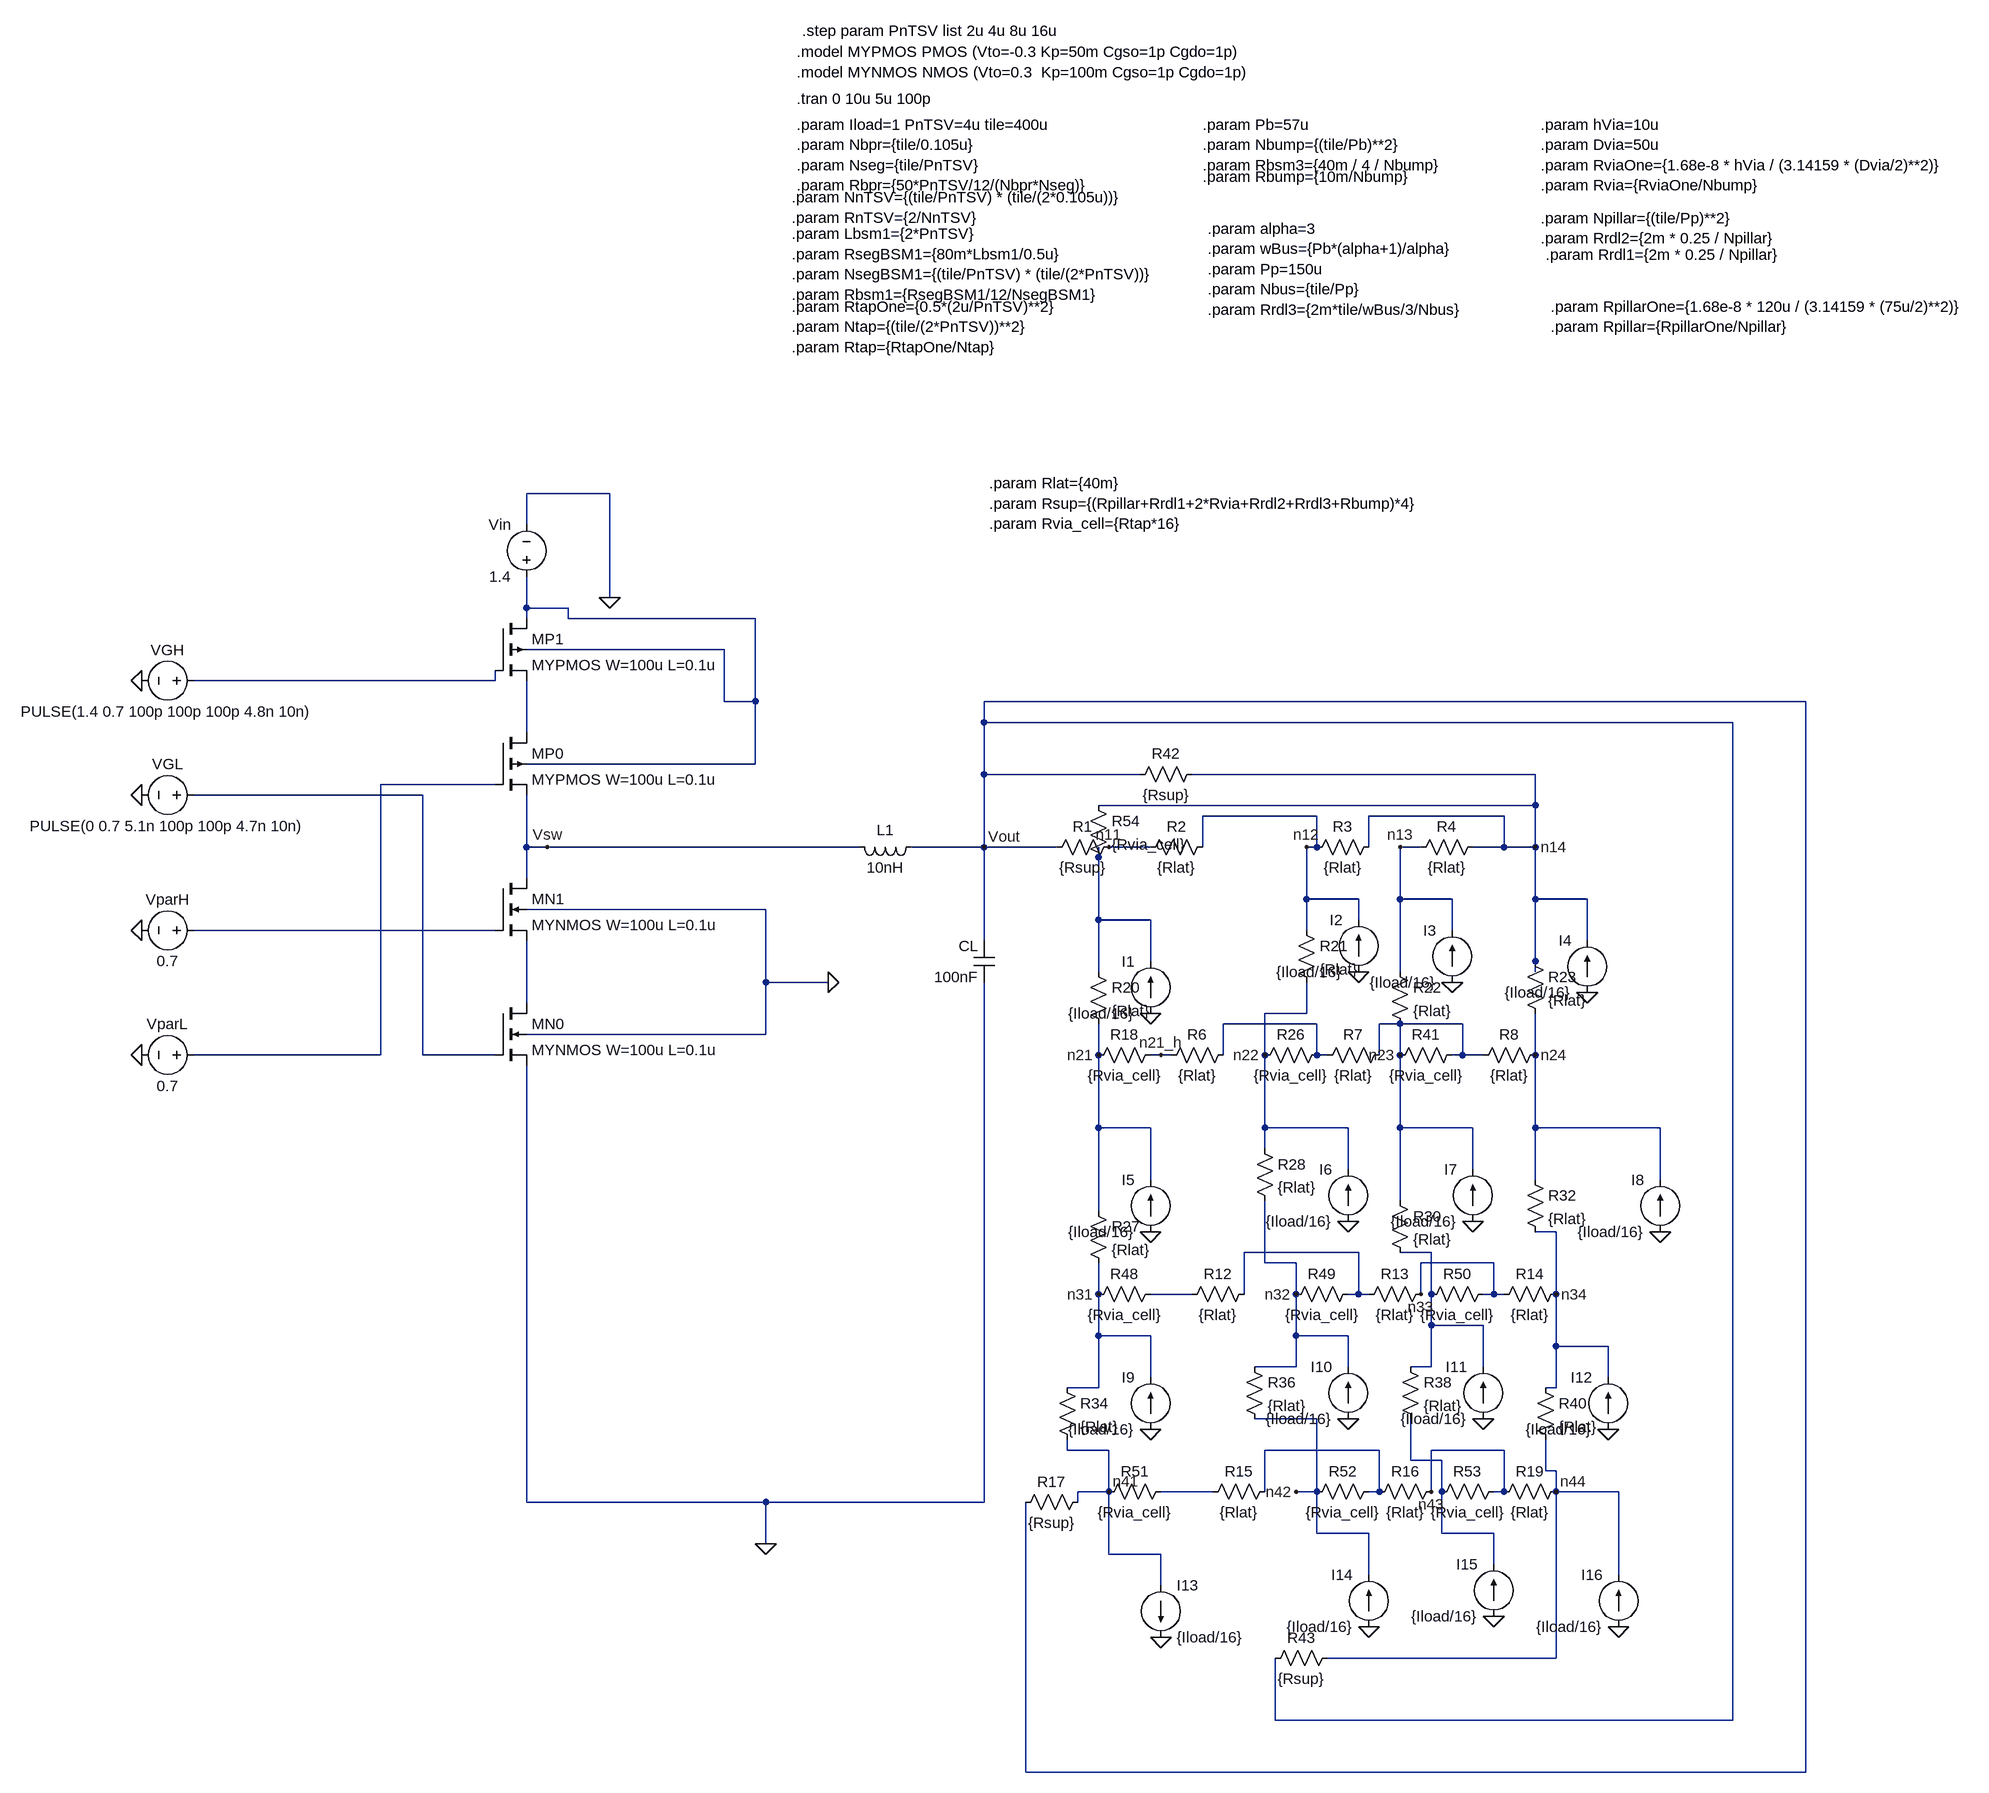
[diagram p0: schematic BuckConverter-WithLayers2D.asc]
BuckConverter-WithLayers2D.asc, the LTspice schematic file:
Version 4.1
SHEET 1 2640 2596
WIRE 448 576 320 576
WIRE 320 624 320 576
WIRE 448 736 448 576
WIRE 320 752 320 704
WIRE 384 752 320 752
WIRE 320 768 320 752
WIRE 384 768 384 752
WIRE 672 768 384 768
WIRE 624 816 320 816
WIRE 272 864 272 848
WIRE 272 864 -192 864
WIRE 624 896 624 816
WIRE 672 896 672 768
WIRE 672 896 624 896
WIRE 2288 896 1024 896
WIRE 1024 928 1024 896
WIRE 2176 928 1024 928
WIRE 320 944 320 864
WIRE 672 992 672 896
WIRE 672 992 320 992
WIRE 1024 1008 1024 928
WIRE 1264 1008 1024 1008
WIRE 1872 1008 1344 1008
WIRE 272 1024 96 1024
WIRE 160 1040 -192 1040
WIRE 1872 1056 1872 1008
WIRE 1872 1056 1200 1056
WIRE 1536 1072 1360 1072
WIRE 1824 1072 1616 1072
WIRE 320 1120 320 1040
WIRE 352 1120 320 1120
WIRE 832 1120 352 1120
WIRE 1024 1120 1024 1008
WIRE 1024 1120 912 1120
WIRE 1136 1120 1024 1120
WIRE 1280 1120 1216 1120
WIRE 1360 1120 1360 1072
WIRE 1536 1120 1536 1072
WIRE 1536 1120 1520 1120
WIRE 1616 1120 1616 1072
WIRE 1696 1120 1664 1120
WIRE 1824 1120 1824 1072
WIRE 1824 1120 1776 1120
WIRE 1872 1120 1872 1056
WIRE 1872 1120 1824 1120
WIRE 1200 1136 1200 1120
WIRE 320 1168 320 1120
WIRE 1520 1200 1520 1120
WIRE 1600 1200 1520 1200
WIRE 1664 1200 1664 1120
WIRE 1744 1200 1664 1200
WIRE 1872 1200 1872 1120
WIRE 1952 1200 1872 1200
WIRE 688 1216 320 1216
WIRE 1200 1232 1200 1136
WIRE 1280 1232 1200 1232
WIRE 1600 1232 1600 1200
WIRE 272 1248 -192 1248
WIRE 1520 1248 1520 1200
WIRE 1744 1248 1744 1200
WIRE 1024 1264 1024 1120
WIRE 1952 1264 1952 1200
WIRE 1280 1296 1280 1232
WIRE 1872 1296 1872 1200
WIRE 1200 1312 1200 1232
WIRE 1664 1312 1664 1200
WIRE 1872 1312 1872 1296
WIRE 688 1328 688 1216
WIRE 784 1328 688 1328
WIRE 320 1360 320 1264
WIRE 1520 1376 1520 1328
WIRE 1520 1376 1456 1376
WIRE 1536 1392 1392 1392
WIRE 1664 1392 1632 1392
WIRE 1760 1392 1664 1392
WIRE 688 1408 688 1328
WIRE 688 1408 320 1408
WIRE 96 1440 96 1024
WIRE 96 1440 -192 1440
WIRE 160 1440 160 1040
WIRE 272 1440 160 1440
WIRE 1200 1440 1200 1392
WIRE 1296 1440 1280 1440
WIRE 1312 1440 1296 1440
WIRE 1392 1440 1392 1392
WIRE 1456 1440 1456 1376
WIRE 1536 1440 1536 1392
WIRE 1552 1440 1536 1440
WIRE 1632 1440 1632 1392
WIRE 1664 1440 1664 1392
WIRE 1760 1440 1760 1392
WIRE 1760 1440 1744 1440
WIRE 1792 1440 1760 1440
WIRE 1872 1440 1872 1376
WIRE 1200 1552 1200 1440
WIRE 1280 1552 1200 1552
WIRE 1456 1552 1456 1440
WIRE 1584 1552 1456 1552
WIRE 1664 1552 1664 1440
WIRE 1776 1552 1664 1552
WIRE 1872 1552 1872 1440
WIRE 2064 1552 1872 1552
WIRE 1456 1584 1456 1552
WIRE 1584 1616 1584 1552
WIRE 1776 1616 1776 1552
WIRE 1280 1632 1280 1552
WIRE 1872 1632 1872 1552
WIRE 2064 1632 2064 1552
WIRE 1664 1664 1664 1552
WIRE 1200 1680 1200 1552
WIRE 1904 1712 1872 1712
WIRE 1600 1744 1424 1744
WIRE 1712 1744 1664 1744
WIRE 1456 1760 1456 1664
WIRE 1504 1760 1456 1760
WIRE 1808 1760 1696 1760
WIRE 1200 1808 1200 1760
WIRE 1344 1808 1280 1808
WIRE 1424 1808 1424 1744
WIRE 1504 1808 1504 1760
WIRE 1600 1808 1600 1744
WIRE 1600 1808 1584 1808
WIRE 1616 1808 1600 1808
WIRE 1696 1808 1696 1760
WIRE 1712 1808 1712 1744
WIRE 1808 1808 1808 1760
WIRE 1808 1808 1792 1808
WIRE 1824 1808 1808 1808
WIRE 1904 1808 1904 1712
WIRE 1712 1856 1712 1808
WIRE 1792 1856 1712 1856
WIRE 1200 1872 1200 1808
WIRE 1280 1872 1200 1872
WIRE 1504 1872 1504 1808
WIRE 1584 1872 1504 1872
WIRE 1904 1888 1904 1808
WIRE 1984 1888 1904 1888
WIRE 1504 1920 1504 1872
WIRE 1504 1920 1440 1920
WIRE 1584 1920 1584 1872
WIRE 1712 1920 1712 1856
WIRE 1712 1920 1680 1920
WIRE 1792 1920 1792 1856
WIRE 1280 1936 1280 1872
WIRE 1984 1936 1984 1888
WIRE 1200 1952 1200 1872
WIRE 1200 1952 1152 1952
WIRE 1904 1952 1904 1888
WIRE 1904 1952 1888 1952
WIRE 1536 2000 1440 2000
WIRE 1152 2048 1152 2032
WIRE 1216 2048 1152 2048
WIRE 1632 2048 1456 2048
WIRE 1824 2048 1712 2048
WIRE 1680 2064 1680 2000
WIRE 1728 2064 1680 2064
WIRE 1888 2080 1888 2032
WIRE 1904 2080 1888 2080
WIRE 1216 2112 1216 2048
WIRE 1216 2112 1168 2112
WIRE 1376 2112 1296 2112
WIRE 1456 2112 1456 2048
WIRE 1536 2112 1536 2000
WIRE 1536 2112 1504 2112
WIRE 1632 2112 1632 2048
WIRE 1632 2112 1616 2112
WIRE 1712 2112 1712 2048
WIRE 1728 2112 1728 2064
WIRE 1824 2112 1824 2048
WIRE 1824 2112 1808 2112
WIRE 1904 2112 1904 2080
WIRE 2000 2112 1904 2112
WIRE 320 2128 320 1456
WIRE 688 2128 320 2128
WIRE 1024 2128 1024 1328
WIRE 1024 2128 688 2128
WIRE 1168 2128 1168 2112
WIRE 1536 2176 1536 2112
WIRE 1616 2176 1536 2176
WIRE 1728 2176 1728 2112
WIRE 1808 2176 1728 2176
WIRE 688 2192 688 2128
WIRE 1216 2208 1216 2112
WIRE 1296 2208 1216 2208
WIRE 1808 2224 1808 2176
WIRE 1616 2240 1616 2176
WIRE 2000 2240 2000 2112
WIRE 1296 2256 1296 2208
WIRE 1904 2368 1904 2112
WIRE 1904 2368 1552 2368
WIRE 1472 2464 1472 2368
WIRE 2176 2464 2176 928
WIRE 2176 2464 1472 2464
WIRE 1088 2544 1088 2128
WIRE 2288 2544 2288 896
WIRE 2288 2544 1088 2544
FLAG 352 1120 Vsw
FLAG 448 736 0
FLAG -272 864 0
FLAG -272 1040 0
FLAG -272 1248 0
FLAG -272 1440 0
FLAG 784 1328 0
FLAG 1024 1120 Vout
FLAG 1216 1120 n11
FLAG 1520 1120 n12
FLAG 1664 1120 n13
FLAG 1872 1120 n14
FLAG 1200 1440 n21
FLAG 1456 1440 n22
FLAG 1664 1440 n23
FLAG 1872 1440 n24
FLAG 1200 1808 n31
FLAG 1504 1808 n32
FLAG 1696 1808 n33
FLAG 1904 1808 n34
FLAG 1216 2112 n41
FLAG 1504 2112 n42
FLAG 1712 2112 n43
FLAG 1904 2112 n44
FLAG 1280 1376 0
FLAG 1600 1312 0
FLAG 1744 1328 0
FLAG 1952 1344 0
FLAG 1280 1712 0
FLAG 1584 1696 0
FLAG 1776 1696 0
FLAG 2064 1712 0
FLAG 1280 2016 0
FLAG 1584 2000 0
FLAG 1792 2000 0
FLAG 1984 2016 0
FLAG 688 2192 0
FLAG 1296 2336 0
FLAG 1616 2320 0
FLAG 1808 2304 0
FLAG 2000 2320 0
FLAG 1296 1440 n21_h
SYMBOL voltage 320 720 R180
WINDOW 0 24 96 Left 2
WINDOW 3 24 16 Left 2
WINDOW 123 0 0 Left 0
WINDOW 39 0 0 Left 0
SYMATTR InstName Vin
SYMATTR Value 1.4
SYMBOL voltage -176 864 R90
WINDOW 0 -32 56 VBottom 2
WINDOW 3 32 56 VTop 2
WINDOW 123 0 0 Left 0
WINDOW 39 0 0 Left 0
SYMATTR InstName VGH
SYMATTR Value PULSE(1.4 0.7 100p 100p 100p 4.8n 10n)
SYMBOL voltage -176 1040 R90
WINDOW 0 -32 56 VBottom 2
WINDOW 3 32 56 VTop 2
WINDOW 123 0 0 Left 0
WINDOW 39 0 0 Left 0
SYMATTR InstName VGL
SYMATTR Value PULSE(0 0.7 5.1n 100p 100p 4.7n 10n)
SYMBOL voltage -176 1248 R90
WINDOW 0 -32 56 VBottom 2
WINDOW 3 32 56 VTop 2
WINDOW 123 0 0 Left 0
WINDOW 39 0 0 Left 0
SYMATTR InstName VparH
SYMATTR Value 0.7
SYMBOL voltage -176 1440 R90
WINDOW 0 -32 56 VBottom 2
WINDOW 3 32 56 VTop 2
WINDOW 123 0 0 Left 0
WINDOW 39 0 0 Left 0
SYMATTR InstName VparL
SYMATTR Value 0.7
SYMBOL pmos4 272 768 R0
SYMATTR InstName MP1
SYMATTR Value MYPMOS W=100u L=0.1u
SYMBOL pmos4 272 944 R0
SYMATTR InstName MP0
SYMATTR Value MYPMOS W=100u L=0.1u
SYMBOL nmos4 272 1168 R0
SYMATTR InstName MN1
SYMATTR Value MYNMOS W=100u L=0.1u
SYMBOL nmos4 272 1360 R0
SYMATTR InstName MN0
SYMATTR Value MYNMOS W=100u L=0.1u
SYMBOL cap 1040 1328 R180
WINDOW 0 24 56 Left 2
WINDOW 3 24 8 Left 2
SYMATTR InstName CL
SYMATTR Value 100nF
SYMBOL ind 928 1104 R90
WINDOW 0 5 56 VBottom 2
WINDOW 3 32 56 VTop 2
SYMATTR InstName L1
SYMATTR Value 10nH
SYMBOL res 1232 1104 R90
WINDOW 0 0 56 VBottom 2
WINDOW 3 32 56 VTop 2
SYMATTR InstName R1
SYMATTR Value {Rsup}
SYMBOL res 1376 1104 R90
WINDOW 0 0 56 VBottom 2
WINDOW 3 32 56 VTop 2
SYMATTR InstName R2
SYMATTR Value {Rlat}
SYMBOL res 1632 1104 R90
WINDOW 0 0 56 VBottom 2
WINDOW 3 32 56 VTop 2
SYMATTR InstName R3
SYMATTR Value {Rlat}
SYMBOL res 1792 1104 R90
WINDOW 0 0 56 VBottom 2
WINDOW 3 32 56 VTop 2
SYMATTR InstName R4
SYMATTR Value {Rlat}
SYMBOL current 1280 1376 R180
WINDOW 0 24 80 Left 2
WINDOW 3 24 0 Left 2
WINDOW 123 0 0 Left 0
WINDOW 39 0 0 Left 0
SYMATTR InstName I1
SYMATTR Value {Iload/16}
SYMBOL res 1408 1424 R90
WINDOW 0 0 56 VBottom 2
WINDOW 3 32 56 VTop 2
SYMATTR InstName R6
SYMATTR Value {Rlat}
SYMBOL res 1648 1424 R90
WINDOW 0 0 56 VBottom 2
WINDOW 3 32 56 VTop 2
SYMATTR InstName R7
SYMATTR Value {Rlat}
SYMBOL res 1888 1424 R90
WINDOW 0 0 56 VBottom 2
WINDOW 3 32 56 VTop 2
SYMATTR InstName R8
SYMATTR Value {Rlat}
SYMBOL current 1600 1312 R180
WINDOW 0 24 80 Left 2
WINDOW 3 24 0 Left 2
WINDOW 123 0 0 Left 0
WINDOW 39 0 0 Left 0
SYMATTR InstName I2
SYMATTR Value {Iload/16}
SYMBOL current 1744 1328 R180
WINDOW 0 24 80 Left 2
WINDOW 3 24 0 Left 2
WINDOW 123 0 0 Left 0
WINDOW 39 0 0 Left 0
SYMATTR InstName I3
SYMATTR Value {Iload/16}
SYMBOL current 1952 1344 R180
WINDOW 0 24 80 Left 2
WINDOW 3 24 0 Left 2
WINDOW 123 0 0 Left 0
WINDOW 39 0 0 Left 0
SYMATTR InstName I4
SYMATTR Value {Iload/16}
SYMBOL res 1440 1792 R90
WINDOW 0 0 56 VBottom 2
WINDOW 3 32 56 VTop 2
SYMATTR InstName R12
SYMATTR Value {Rlat}
SYMBOL res 1712 1792 R90
WINDOW 0 0 56 VBottom 2
WINDOW 3 32 56 VTop 2
SYMATTR InstName R13
SYMATTR Value {Rlat}
SYMBOL res 1920 1792 R90
WINDOW 0 0 56 VBottom 2
WINDOW 3 32 56 VTop 2
SYMATTR InstName R14
SYMATTR Value {Rlat}
SYMBOL res 1472 2096 R90
WINDOW 0 0 56 VBottom 2
WINDOW 3 32 56 VTop 2
SYMATTR InstName R15
SYMATTR Value {Rlat}
SYMBOL res 1920 2096 R90
WINDOW 0 0 56 VBottom 2
WINDOW 3 32 56 VTop 2
SYMATTR InstName R19
SYMATTR Value {Rlat}
SYMBOL res 1184 1296 R0
SYMATTR InstName R20
SYMATTR Value {Rlat}
SYMBOL res 1504 1232 R0
SYMATTR InstName R21
SYMATTR Value {Rlat}
SYMBOL res 1648 1296 R0
SYMATTR InstName R22
SYMATTR Value {Rlat}
SYMBOL res 1856 1280 R0
SYMATTR InstName R23
SYMATTR Value {Rlat}
SYMBOL current 1280 1712 R180
WINDOW 0 24 80 Left 2
WINDOW 3 24 0 Left 2
WINDOW 123 0 0 Left 0
WINDOW 39 0 0 Left 0
SYMATTR InstName I5
SYMATTR Value {Iload/16}
SYMBOL current 1584 1696 R180
WINDOW 0 24 80 Left 2
WINDOW 3 24 0 Left 2
WINDOW 123 0 0 Left 0
WINDOW 39 0 0 Left 0
SYMATTR InstName I6
SYMATTR Value {Iload/16}
SYMBOL res 1184 1664 R0
SYMATTR InstName R27
SYMATTR Value {Rlat}
SYMBOL res 1440 1568 R0
SYMATTR InstName R28
SYMATTR Value {Rlat}
SYMBOL current 1776 1696 R180
WINDOW 0 24 80 Left 2
WINDOW 3 24 0 Left 2
WINDOW 123 0 0 Left 0
WINDOW 39 0 0 Left 0
SYMATTR InstName I7
SYMATTR Value {Iload/16}
SYMBOL res 1648 1648 R0
SYMATTR InstName R30
SYMATTR Value {Rlat}
SYMBOL current 2064 1712 R180
WINDOW 0 24 80 Left 2
WINDOW 3 24 0 Left 2
WINDOW 123 0 0 Left 0
WINDOW 39 0 0 Left 0
SYMATTR InstName I8
SYMATTR Value {Iload/16}
SYMBOL res 1856 1616 R0
SYMATTR InstName R32
SYMATTR Value {Rlat}
SYMBOL current 1280 2016 R180
WINDOW 0 24 80 Left 2
WINDOW 3 24 0 Left 2
WINDOW 123 0 0 Left 0
WINDOW 39 0 0 Left 0
SYMATTR InstName I9
SYMATTR Value {Iload/16}
SYMBOL res 1136 1936 R0
SYMATTR InstName R34
SYMATTR Value {Rlat}
SYMBOL current 1584 2000 R180
WINDOW 0 24 80 Left 2
WINDOW 3 24 0 Left 2
WINDOW 123 0 0 Left 0
WINDOW 39 0 0 Left 0
SYMATTR InstName I10
SYMATTR Value {Iload/16}
SYMBOL res 1424 1904 R0
SYMATTR InstName R36
SYMATTR Value {Rlat}
SYMBOL current 1792 2000 R180
WINDOW 0 24 80 Left 2
WINDOW 3 24 0 Left 2
WINDOW 123 0 0 Left 0
WINDOW 39 0 0 Left 0
SYMATTR InstName I11
SYMATTR Value {Iload/16}
SYMBOL res 1664 1904 R0
SYMATTR InstName R38
SYMATTR Value {Rlat}
SYMBOL current 1984 2016 R180
WINDOW 0 24 80 Left 2
WINDOW 3 24 0 Left 2
WINDOW 123 0 0 Left 0
WINDOW 39 0 0 Left 0
SYMATTR InstName I12
SYMATTR Value {Iload/16}
SYMBOL res 1872 1936 R0
SYMATTR InstName R40
SYMATTR Value {Rlat}
SYMBOL res 1360 992 R90
WINDOW 0 0 56 VBottom 2
WINDOW 3 32 56 VTop 2
SYMATTR InstName R42
SYMATTR Value {Rsup}
SYMBOL res 1568 2352 R90
WINDOW 0 0 56 VBottom 2
WINDOW 3 32 56 VTop 2
SYMATTR InstName R43
SYMATTR Value {Rsup}
SYMBOL current 1296 2256 R0
WINDOW 123 0 0 Left 0
WINDOW 39 0 0 Left 0
SYMATTR InstName I13
SYMATTR Value {Iload/16}
SYMBOL current 1616 2320 R180
WINDOW 0 24 80 Left 2
WINDOW 3 24 0 Left 2
WINDOW 123 0 0 Left 0
WINDOW 39 0 0 Left 0
SYMATTR InstName I14
SYMATTR Value {Iload/16}
SYMBOL current 1808 2304 R180
WINDOW 0 24 80 Left 2
WINDOW 3 24 0 Left 2
WINDOW 123 0 0 Left 0
WINDOW 39 0 0 Left 0
SYMATTR InstName I15
SYMATTR Value {Iload/16}
SYMBOL current 2000 2320 R180
WINDOW 0 24 80 Left 2
WINDOW 3 24 0 Left 2
WINDOW 123 0 0 Left 0
WINDOW 39 0 0 Left 0
SYMATTR InstName I16
SYMATTR Value {Iload/16}
SYMBOL res 1728 2096 R90
WINDOW 0 0 56 VBottom 2
WINDOW 3 32 56 VTop 2
SYMATTR InstName R16
SYMATTR Value {Rlat}
SYMBOL res 1184 2112 R90
WINDOW 0 0 56 VBottom 2
WINDOW 3 32 56 VTop 2
SYMATTR InstName R17
SYMATTR Value {Rsup}
SYMBOL res 1312 2096 R90
WINDOW 0 0 56 VBottom 2
WINDOW 3 32 56 VTop 2
SYMATTR InstName R51
SYMATTR Value {Rvia_cell}
SYMBOL res 1632 2096 R90
WINDOW 0 0 56 VBottom 2
WINDOW 3 32 56 VTop 2
SYMATTR InstName R52
SYMATTR Value {Rvia_cell}
SYMBOL res 1824 2096 R90
WINDOW 0 0 56 VBottom 2
WINDOW 3 32 56 VTop 2
SYMATTR InstName R53
SYMATTR Value {Rvia_cell}
SYMBOL res 1296 1792 R90
WINDOW 0 0 56 VBottom 2
WINDOW 3 32 56 VTop 2
SYMATTR InstName R48
SYMATTR Value {Rvia_cell}
SYMBOL res 1600 1792 R90
WINDOW 0 0 56 VBottom 2
WINDOW 3 32 56 VTop 2
SYMATTR InstName R49
SYMATTR Value {Rvia_cell}
SYMBOL res 1808 1792 R90
WINDOW 0 0 56 VBottom 2
WINDOW 3 32 56 VTop 2
SYMATTR InstName R50
SYMATTR Value {Rvia_cell}
SYMBOL res 1296 1424 R90
WINDOW 0 0 56 VBottom 2
WINDOW 3 32 56 VTop 2
SYMATTR InstName R18
SYMATTR Value {Rvia_cell}
SYMBOL res 1552 1424 R90
WINDOW 0 0 56 VBottom 2
WINDOW 3 32 56 VTop 2
SYMATTR InstName R26
SYMATTR Value {Rvia_cell}
SYMBOL res 1760 1424 R90
WINDOW 0 0 56 VBottom 2
WINDOW 3 32 56 VTop 2
SYMATTR InstName R41
SYMATTR Value {Rvia_cell}
SYMBOL res 1184 1040 R0
SYMATTR InstName R54
SYMATTR Value {Rvia_cell}
TEXT 736 -104 Left 2 !.model MYPMOS PMOS (Vto=-0.3 Kp=50m Cgso=1p Cgdo=1p)\n.model MYNMOS NMOS (Vto=0.3  Kp=100m Cgso=1p Cgdo=1p)
TEXT 736 -32 Left 2 !.tran 0 10u 5u 100p
TEXT 736 8 Left 2 !.param Iload=1 PnTSV=4u tile=400u\n.param Nbpr={tile/0.105u}\n.param Nseg={tile/PnTSV}\n.param Rbpr={50*PnTSV/12/(Nbpr*Nseg)}
TEXT 728 120 Left 2 !.param NnTSV={(tile/PnTSV) * (tile/(2*0.105u))}\n.param RnTSV={2/NnTSV}
TEXT 728 176 Left 2 !.param Lbsm1={2*PnTSV}\n.param RsegBSM1={80m*Lbsm1/0.5u}\n.param NsegBSM1={(tile/PnTSV) * (tile/(2*PnTSV))}\n.param Rbsm1={RsegBSM1/12/NsegBSM1}
TEXT 728 288 Left 2 !.param RtapOne={0.5*(2u/PnTSV)**2}\n.param Ntap={(tile/(2*PnTSV))**2}\n.param Rtap={RtapOne/Ntap}
TEXT 1360 8 Left 2 !.param Pb=57u\n.param Nbump={(tile/Pb)**2}\n.param Rbsm3={40m / 4 / Nbump}
TEXT 1360 88 Left 2 !.param Rbump={10m/Nbump}
TEXT 1368 168 Left 2 !.param alpha=3\n.param wBus={Pb*(alpha+1)/alpha}\n.param Pp=150u\n.param Nbus={tile/Pp}\n.param Rrdl3={2m*tile/wBus/3/Nbus}
TEXT 1880 8 Left 2 !.param hVia=10u\n.param Dvia=50u\n.param RviaOne={1.68e-8 * hVia / (3.14159 * (Dvia/2)**2)}\n.param Rvia={RviaOne/Nbump}
TEXT 1880 152 Left 2 !.param Npillar={(tile/Pp)**2}\n.param Rrdl2={2m * 0.25 / Npillar}
TEXT 1888 208 Left 2 !.param Rrdl1={2m * 0.25 / Npillar}
TEXT 1896 288 Left 2 !.param RpillarOne={1.68e-8 * 120u / (3.14159 * (75u/2)**2)}\n.param Rpillar={RpillarOne/Npillar}
TEXT 744 -136 Left 2 !.step param PnTSV list 2u 4u 8u 16u
TEXT 1032 560 Left 2 !.param Rlat={40m}                          \n.param Rsup={(Rpillar+Rrdl1+2*Rvia+Rrdl2+Rrdl3+Rbump)*4}\n.param Rvia_cell={Rtap*16}

The netlist it stands for:
* BuckConverter-WithLayers2D.asc
Vin N001 0 1.4
VGH N002 0 PULSE(1.4 0.7 100p 100p 100p 4.8n 10n)
VGL N005 0 PULSE(0 0.7 5.1n 100p 100p 4.7n 10n)
VparH N007 0 0.7
VparL N004 0 0.7
MP1 N001 N002 N003 N001 MYPMOS W=100u L=0.1u
MP0 N003 N004 Vsw N001 MYPMOS W=100u L=0.1u
MN1 Vsw N007 N008 0 MYNMOS W=100u L=0.1u
MN0 N008 N005 0 0 MYNMOS W=100u L=0.1u
CL 0 Vout 100nF
L1 Vout Vsw 10nH
R1 n11 Vout {Rsup}
R2 n12 n11 {Rlat}
R3 n14 n12 {Rlat}
R4 n14 n13 {Rlat}
I1 0 N006 {Iload/16}
R6 N009 n21_h {Rlat}
R7 n23 N009 {Rlat}
R8 n24 n23 {Rlat}
I2 0 n12 {Iload/16}
I3 0 n13 {Iload/16}
I4 0 n14 {Iload/16}
R12 N010 N012 {Rlat}
R13 n33 N010 {Rlat}
R14 n34 n33 {Rlat}
R15 N013 N015 {Rlat}
R19 n44 n43 {Rlat}
R20 N006 n21 {Rlat}
R21 n12 n22 {Rlat}
R22 n13 n23 {Rlat}
R23 n14 n24 {Rlat}
I5 0 n21 {Iload/16}
I6 0 n22 {Iload/16}
R27 n21 n31 {Rlat}
R28 n22 n32 {Rlat}
I7 0 n23 {Iload/16}
R30 n23 N011 {Rlat}
I8 0 n24 {Iload/16}
R32 n24 n34 {Rlat}
I9 0 n31 {Iload/16}
R34 n31 n41 {Rlat}
I10 0 n32 {Iload/16}
R36 n32 n42 {Rlat}
I11 0 N011 {Iload/16}
R38 N011 N014 {Rlat}
I12 0 n34 {Iload/16}
R40 n34 n44 {Rlat}
R42 n14 Vout {Rsup}
R43 n44 Vout {Rsup}
I13 n41 0 {Iload/16}
I14 0 n42 {Iload/16}
I15 0 N014 {Iload/16}
I16 0 n44 {Iload/16}
R16 n43 N013 {Rlat}
R17 n41 Vout {Rsup}
R51 N015 n41 {Rvia_cell}
R52 N013 n42 {Rvia_cell}
R53 n43 N014 {Rvia_cell}
R48 N012 n31 {Rvia_cell}
R49 N010 n32 {Rvia_cell}
R50 n33 N011 {Rvia_cell}
R18 n21_h n21 {Rvia_cell}
R26 N009 n22 {Rvia_cell}
R41 n23 n23 {Rvia_cell}
R54 n14 N006 {Rvia_cell}
.model NMOS NMOS
.model PMOS PMOS
.lib standard.mos
.model MYPMOS PMOS (Vto=-0.3 Kp=50m Cgso=1p Cgdo=1p)
.model MYNMOS NMOS (Vto=0.3  Kp=100m Cgso=1p Cgdo=1p)
.tran 0 10u 5u 100p
.param Iload=1 PnTSV=4u tile=400u
.param Nbpr={tile/0.105u}
.param Nseg={tile/PnTSV}
.param Rbpr={50*PnTSV/12/(Nbpr*Nseg)}
.param NnTSV={(tile/PnTSV) * (tile/(2*0.105u))}
.param RnTSV={2/NnTSV}
.param Lbsm1={2*PnTSV}
.param RsegBSM1={80m*Lbsm1/0.5u}
.param NsegBSM1={(tile/PnTSV) * (tile/(2*PnTSV))}
.param Rbsm1={RsegBSM1/12/NsegBSM1}
.param RtapOne={0.5*(2u/PnTSV)**2}
.param Ntap={(tile/(2*PnTSV))**2}
.param Rtap={RtapOne/Ntap}
.param Pb=57u
.param Nbump={(tile/Pb)**2}
.param Rbsm3={40m / 4 / Nbump}
.param Rbump={10m/Nbump}
.param alpha=3
.param wBus={Pb*(alpha+1)/alpha}
.param Pp=150u
.param Nbus={tile/Pp}
.param Rrdl3={2m*tile/wBus/3/Nbus}
.param hVia=10u
.param Dvia=50u
.param RviaOne={1.68e-8 * hVia / (3.14159 * (Dvia/2)**2)}
.param Rvia={RviaOne/Nbump}
.param Npillar={(tile/Pp)**2}
.param Rrdl2={2m * 0.25 / Npillar}
.param Rrdl1={2m * 0.25 / Npillar}
.param RpillarOne={1.68e-8 * 120u / (3.14159 * (75u/2)**2)}
.param Rpillar={RpillarOne/Npillar}
.step param PnTSV list 2u 4u 8u 16u
.param Rlat={40m}
.param Rsup={(Rpillar+Rrdl1+2*Rvia+Rrdl2+Rrdl3+Rbump)*4}
.param Rvia_cell={Rtap*16}
.backanno
.end